# Altium schematic sheet 2K res.schdoc
size 127 x 99 mm
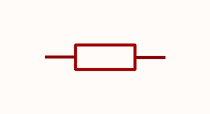
[diagram p0: 2K res.schdoc]

## Parts
R?  2kΩ  [R0402]  (value not drawn)

## Nets

Not connected (* = marked no-connect by the designer): R? 1 2

## Library data of the parts
R? = RC-02W2001FT: Manufacturer: FH(风华); Add into BOM: yes; Tolerance: ±1%; Temperature Coefficient: ±200ppm/℃; Symbol: RC-02W2001FT; Device: RC-02W2001FT; LCSC Part Name: 厚膜电阻 2kΩ ±1% 62.5mW; Supplier Part: C304583; Manufacturer Part: RC-02W2001FT; Supplier Footprint: 0402; JLCPCB Part Class: Extended Part; Datasheet: https://atta.szlcsc.com/upload/public/pdf/source/20190505/C118335_36085569433BA7FFC796E569DBFE3139.pdf; Supplier: LCSC; Convert to PCB: yes; Type: Thick Film Resistors; Value: 2kΩ; Operating Temperature Range: -55℃~+155℃